# Altium schematic sheet Filter Capacitors - Port C.SchDoc: PORT C Filter Capacitors
size A4; DocumentNumber: 30; SheetNumber: 30; SheetTotal: 54
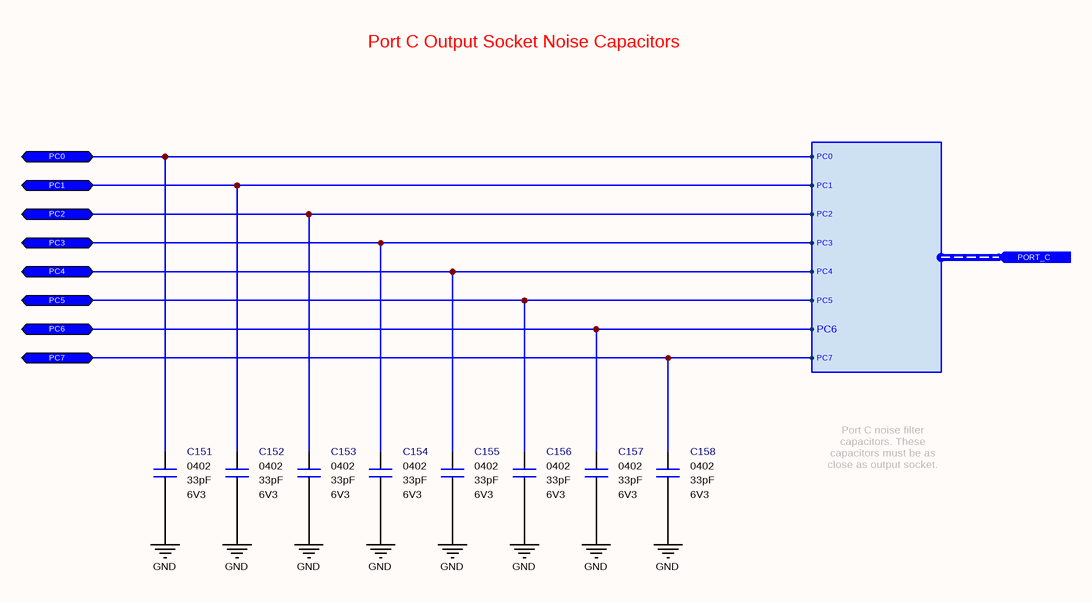
[diagram p0: Filter Capacitors - Port C.SchDoc]

## Parts
C151  value 33pF  Case: 0402  Voltage: 6V3  [CAPACITOR_0402]  (hidden comment: Multilayer Ceramic Capacitor)
C152  value 33pF  Case: 0402  Voltage: 6V3  [CAPACITOR_0402]  (hidden comment: Multilayer Ceramic Capacitor)
C153  value 33pF  Case: 0402  Voltage: 6V3  [CAPACITOR_0402]  (hidden comment: Multilayer Ceramic Capacitor)
C154  value 33pF  Case: 0402  Voltage: 6V3  [CAPACITOR_0402]  (hidden comment: Multilayer Ceramic Capacitor)
C155  value 33pF  Case: 0402  Voltage: 6V3  [CAPACITOR_0402]  (hidden comment: Multilayer Ceramic Capacitor)
C156  value 33pF  Case: 0402  Voltage: 6V3  [CAPACITOR_0402]  (hidden comment: Multilayer Ceramic Capacitor)
C157  value 33pF  Case: 0402  Voltage: 6V3  [CAPACITOR_0402]  (hidden comment: Multilayer Ceramic Capacitor)
C158  value 33pF  Case: 0402  Voltage: 6V3  [CAPACITOR_0402]  (hidden comment: Multilayer Ceramic Capacitor)

## Ports
PC0 (bidir), PC1 (bidir), PC2 (bidir), PC3 (bidir), PC4 (bidir), PC5 (bidir), PC6 (bidir), PC7 (bidir), PORT_C (in, harness PORT_C)

## Harnesses
PORT_C: PC0, PC1, PC2, PC3, PC4, PC5, PC7, PC6

## Nets
GND: C151.1 C152.1 C153.1 C154.1 C155.1 C156.1 C157.1 C158.1
PC0: C151.2 ; port PC0, port PORT_C.PC0
PC1: C152.2 ; port PC1, port PORT_C.PC1
PC2: C153.2 ; port PC2, port PORT_C.PC2
PC3: C154.2 ; port PC3, port PORT_C.PC3
PC4: C155.2 ; port PC4, port PORT_C.PC4
PC5: C156.2 ; port PC5, port PORT_C.PC5
PC6: C157.2 ; port PC6, port PORT_C.PC6
PC7: C158.2 ; port PC7, port PORT_C.PC7

## Notes on the sheet
- Port C Output Socket Noise Capacitors
- Port C noise filter capacitors. These capacitors must be as close as output socket.
- Title
- Size:
- Date:
- A4
- Number:
- Time:
- Revision:
- Sheet
- of
- File:

## Library data of the parts
C151-C158 = Capacitor - 33pF [0402-6V3]: Capacitor - 33pF [0402] (Ceramic); Manufacturer Name: Kemet; Manufacturer Part Number: C0402C330J9RACAUTO; Dielectric: X7R; Tolerance: 10%; Height: 0.5mm; Maximum Operating Temperature: +125; Minimum Operating Temperature: -55; ROHS: Yes; ComponentLink1Description: DataSheet; ComponentLink1URL: https://api.kemet.com/component-edge/download/datasheet/C0402C330J9RACAUTO.pdf; ComponentLink2Description: Mouser; ComponentLink2URL: https://www.mouser.com/Search/Refine.aspx?Keyword=80-C0402C330J9RAUTO; Supplier 1: Mouser; Supplier Part Number 1: 80-C0402C330J9RAUTO; Mouser Part Number: 80-C0402C330J9RAUTO